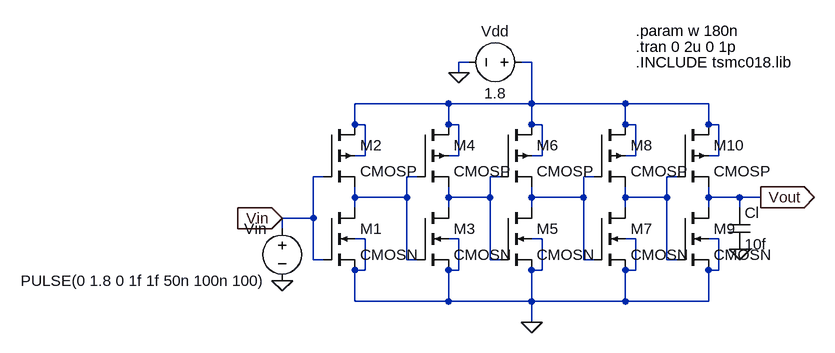
[diagram p0: schematic obj1.asc]
obj1.asc, the LTspice schematic file:
Version 4
SHEET 1 932 680
WIRE 384 -48 368 -48
WIRE 480 -48 464 -48
WIRE 368 -32 368 -48
WIRE 352 16 208 16
WIRE 480 16 480 -48
WIRE 480 16 352 16
WIRE 624 16 480 16
WIRE 752 16 624 16
WIRE 208 48 208 16
WIRE 224 48 208 48
WIRE 352 48 352 16
WIRE 368 48 352 48
WIRE 480 48 480 16
WIRE 496 48 480 48
WIRE 624 48 624 16
WIRE 640 48 624 48
WIRE 752 48 752 16
WIRE 768 48 752 48
WIRE 224 96 224 48
WIRE 224 96 208 96
WIRE 368 96 368 48
WIRE 368 96 352 96
WIRE 496 96 496 48
WIRE 496 96 480 96
WIRE 640 96 640 48
WIRE 640 96 624 96
WIRE 768 96 768 48
WIRE 768 96 752 96
WIRE 160 128 144 128
WIRE 304 128 288 128
WIRE 432 128 416 128
WIRE 576 128 560 128
WIRE 704 128 688 128
WIRE 208 160 208 144
WIRE 288 160 288 128
WIRE 288 160 208 160
WIRE 352 160 352 144
WIRE 416 160 416 128
WIRE 416 160 352 160
WIRE 480 160 480 144
WIRE 560 160 560 128
WIRE 560 160 480 160
WIRE 624 160 624 144
WIRE 688 160 688 128
WIRE 688 160 624 160
WIRE 752 160 752 144
WIRE 800 160 752 160
WIRE 832 160 800 160
WIRE 208 176 208 160
WIRE 352 176 352 160
WIRE 480 176 480 160
WIRE 624 176 624 160
WIRE 752 176 752 160
WIRE 800 176 800 160
WIRE 144 192 144 128
WIRE 144 192 96 192
WIRE 96 208 96 192
WIRE 224 224 208 224
WIRE 368 224 352 224
WIRE 496 224 480 224
WIRE 640 224 624 224
WIRE 768 224 752 224
WIRE 144 256 144 192
WIRE 160 256 144 256
WIRE 288 256 288 160
WIRE 304 256 288 256
WIRE 416 256 416 160
WIRE 432 256 416 256
WIRE 560 256 560 160
WIRE 576 256 560 256
WIRE 688 256 688 160
WIRE 704 256 688 256
WIRE 224 272 224 224
WIRE 224 272 208 272
WIRE 368 272 368 224
WIRE 368 272 352 272
WIRE 496 272 496 224
WIRE 496 272 480 272
WIRE 640 272 640 224
WIRE 640 272 624 272
WIRE 768 272 768 224
WIRE 768 272 752 272
WIRE 208 320 208 272
WIRE 352 320 352 272
WIRE 352 320 208 320
WIRE 480 320 480 272
WIRE 480 320 352 320
WIRE 624 320 624 272
WIRE 624 320 480 320
WIRE 752 320 752 272
WIRE 752 320 624 320
WIRE 480 352 480 320
FLAG 480 352 0
FLAG 368 -32 0
FLAG 96 288 0
FLAG 800 240 0
FLAG 832 160 Vout
IOPIN 832 160 Out
FLAG 96 192 Vin
IOPIN 96 192 In
SYMBOL cmosn 160 176 R0
SYMATTR InstName M1
SYMATTR Value2 l=180n w=180n
SYMBOL cmosp 160 48 R0
SYMATTR InstName M2
SYMATTR Value2 l=180n w=360n
SYMBOL cmosn 304 176 R0
SYMATTR InstName M3
SYMATTR Value2 l=180n w=720n
SYMBOL cmosp 304 48 R0
SYMATTR InstName M4
SYMATTR Value2 l=180n w=1440n
SYMBOL cmosn 432 176 R0
SYMATTR InstName M5
SYMATTR Value2 l=180n w=2880n
SYMBOL cmosp 432 48 R0
SYMATTR InstName M6
SYMATTR Value2 l=180n w=5760n
SYMBOL cmosn 576 176 R0
SYMATTR InstName M7
SYMATTR Value2 l=180n w=11520n
SYMBOL cmosp 576 48 R0
SYMATTR InstName M8
SYMATTR Value2 l=180n w=23040n
SYMBOL cmosn 704 176 R0
SYMATTR InstName M9
SYMATTR Value2 l=180n w=46080n
SYMBOL cmosp 704 48 R0
SYMATTR InstName M10
SYMATTR Value2 l=180n w=92160n
SYMBOL Voltage 480 -48 M270
WINDOW 0 32 56 VTop 0
WINDOW 3 -32 56 VBottom 0
SYMATTR InstName Vdd
SYMATTR Value 1.8
SYMBOL Voltage 96 192 M0
WINDOW 0 24 16 Left 0
WINDOW 3 24 96 Left 0
SYMATTR InstName Vin
SYMATTR Value PULSE(0 1.8 0 1f 1f 50n 100n 100)
SYMBOL Cap 784 176 R0
WINDOW 0 24 8 Left 0
WINDOW 3 24 56 Left 0
SYMATTR InstName Cl
SYMATTR Value 10f
TEXT 640 -72 Left 0 !.tran 0 2u 0 1p
TEXT 640 -48 Left 0 !.INCLUDE tsmc018.lib
TEXT 640 -96 Left 0 !.param w 180n

The netlist it stands for:
* obj1.asc
M1 N002 Vin 0 0 CMOSN l=180n w=180n
M2 N001 Vin N002 N001 CMOSP l=180n w=360n
M3 N003 N002 0 0 CMOSN l=180n w=720n
M4 N001 N002 N003 N001 CMOSP l=180n w=1440n
M5 N004 N003 0 0 CMOSN l=180n w=2880n
M6 N001 N003 N004 N001 CMOSP l=180n w=5760n
M7 N005 N004 0 0 CMOSN l=180n w=11520n
M8 N001 N004 N005 N001 CMOSP l=180n w=23040n
M9 Vout N005 0 0 CMOSN l=180n w=46080n
M10 N001 N005 Vout N001 CMOSP l=180n w=92160n
Vdd N001 0 1.8
Vin Vin 0 PULSE(0 1.8 0 1f 1f 50n 100n 100)
Cl Vout 0 10f
.model NMOS NMOS
.model PMOS PMOS
.lib standard.mos
.tran 0 2u 0 1p
.INCLUDE tsmc018.lib
.param w 180n
.backanno
.end